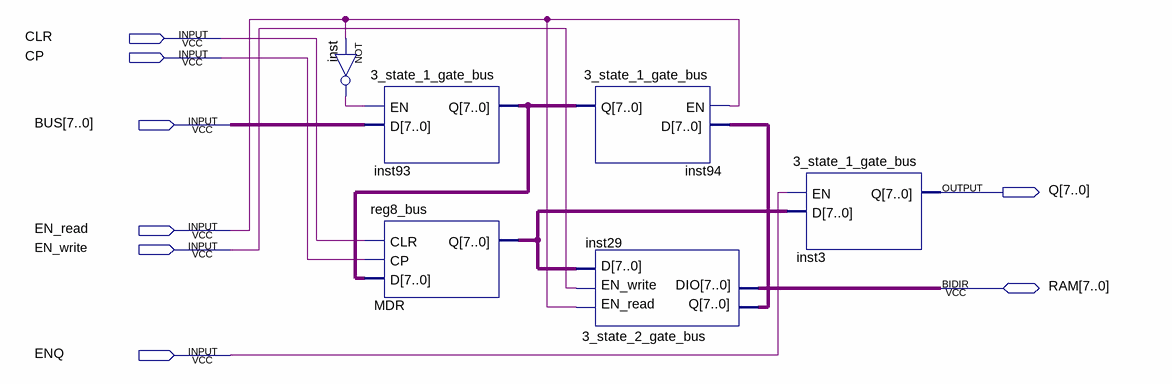
[diagram p0: schematic sheet]
// Quartus schematic mdr_bus.bdf as structural Verilog: 6 symbols, 8 pins
module mdr_bus (
  input  CLR,
  input  CP,
  input  [7:0] BUS,
  input  EN_read,
  input  EN_write,
  input  ENQ,
  inout  [7:0] RAM,
  output [7:0] Q
);

  wire inst_out;
  wire [7:0] inst29_q, inst93_q, MDR_q;

  not inst (inst_out, EN_read);
  \3_state_1_gate_bus  inst93 (.EN(inst_out), .D(BUS), .Q(inst93_q));
  reg8_bus MDR (.CLR(CLR), .CP(CP), .D(inst93_q), .Q(MDR_q));
  \3_state_1_gate_bus  inst94 (.EN(EN_read), .D(inst29_q), .Q(inst93_q));
  \3_state_2_gate_bus  inst29 (.EN_read(EN_read), .EN_write(EN_write), .D(MDR_q), .Q(inst29_q), .DIO(RAM));
  \3_state_1_gate_bus  inst3 (.EN(ENQ), .D(MDR_q), .Q(Q));
endmodule
